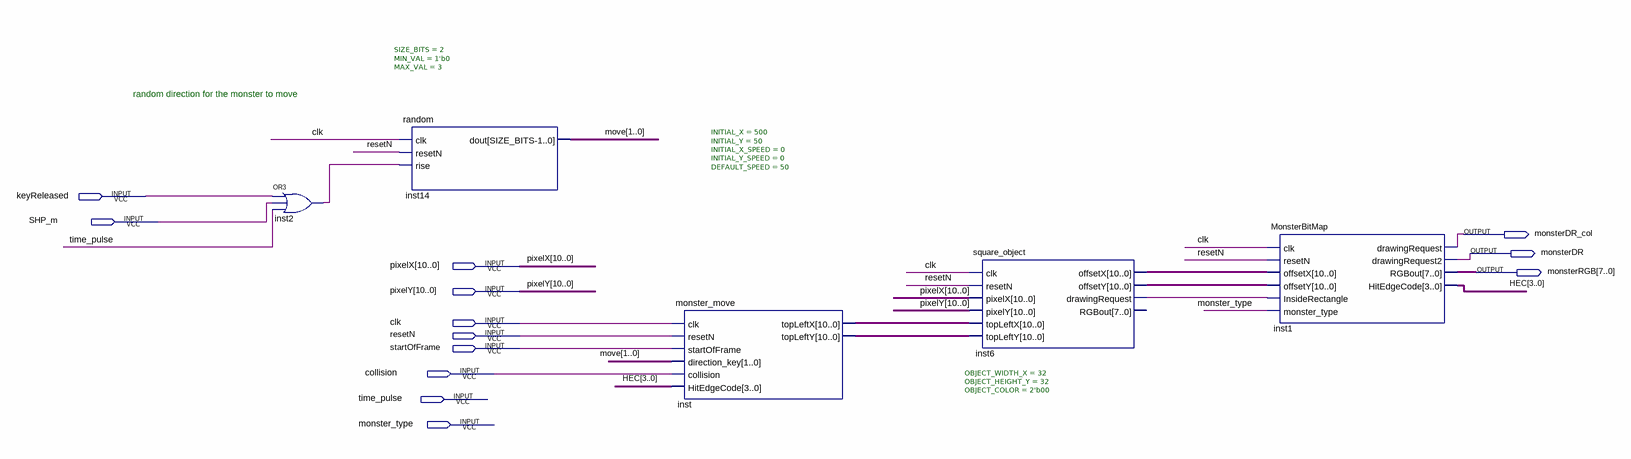
[diagram p0: schematic sheet]
// Quartus schematic monster_block.bdf as structural Verilog: 5 symbols, 13 pins
module monster_block (
  input  keyReleased,
  input  SHP_m,
  input  [10:0] pixelX,
  input  [10:0] pixelY,
  input  clk,
  input  resetN,
  input  startOfFrame,
  input  collision,
  input  time_pulse,
  input  monster_type,
  output monsterDR_col,
  output monsterDR,
  output [7:0] monsterRGB
);

  wire inst2_out, inst6_drawingrequest;
  wire [1:0] move;
  wire [3:0] HEC;
  wire [10:0] inst6_offsetx, inst6_offsety, inst_topleftx, inst_toplefty;

  or inst2 (inst2_out, keyReleased, SHP_m, time_pulse);
  random #(.SIZE_BITS(2), .MIN_VAL(1'b0), .MAX_VAL(3)) inst14 (
    .clk(clk), .resetN(resetN), .rise(inst2_out), .dout(move));
  monster_move #(.INITIAL_X(500), .INITIAL_Y(50), .INITIAL_X_SPEED(0), .INITIAL_Y_SPEED(0), .DEFAULT_SPEED(50)) inst (
    .clk(clk), .resetN(resetN), .startOfFrame(startOfFrame), .direction_key(move), .collision(collision),
    .HitEdgeCode(HEC), .topLeftX(inst_topleftx), .topLeftY(inst_toplefty));
  square_object #(.OBJECT_WIDTH_X(32), .OBJECT_HEIGHT_Y(32), .OBJECT_COLOR(2'b00)) inst6 (
    .clk(clk), .resetN(resetN), .pixelX(pixelX), .pixelY(pixelY), .topLeftX(inst_topleftx),
    .topLeftY(inst_toplefty), .offsetX(inst6_offsetx), .offsetY(inst6_offsety),
    .drawingRequest(inst6_drawingrequest));  // open: RGBout
  MonsterBitMap inst1 (
    .clk(clk), .resetN(resetN), .offsetX(inst6_offsetx), .offsetY(inst6_offsety),
    .InsideRectangle(inst6_drawingrequest), .monster_type(monster_type), .drawingRequest(monsterDR_col),
    .drawingRequest2(monsterDR), .RGBout(monsterRGB), .HitEdgeCode(HEC));

  // Notes on the sheet:
  //   random direction for the monster to move
endmodule
